# Altium schematic sheet Main.SchDoc
size A4
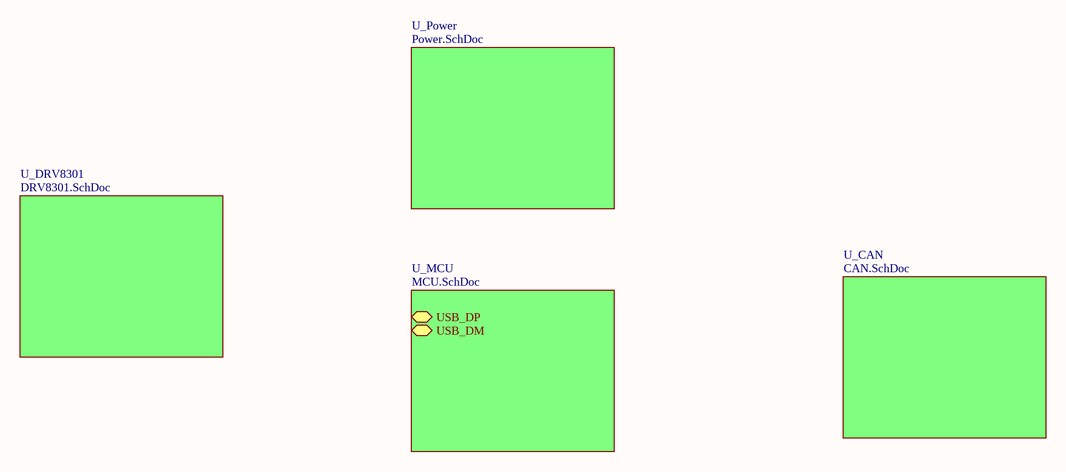
[diagram p0: Main.SchDoc]

## Sub-sheets
U_CAN = CAN.SchDoc: no entries
U_DRV8301 = DRV8301.SchDoc: no entries
U_MCU = MCU.SchDoc: USB_DP (bidir), USB_DM (bidir)
U_Power = Power.SchDoc: no entries